# Altium schematic sheet Termoclanok.SchDoc
size A
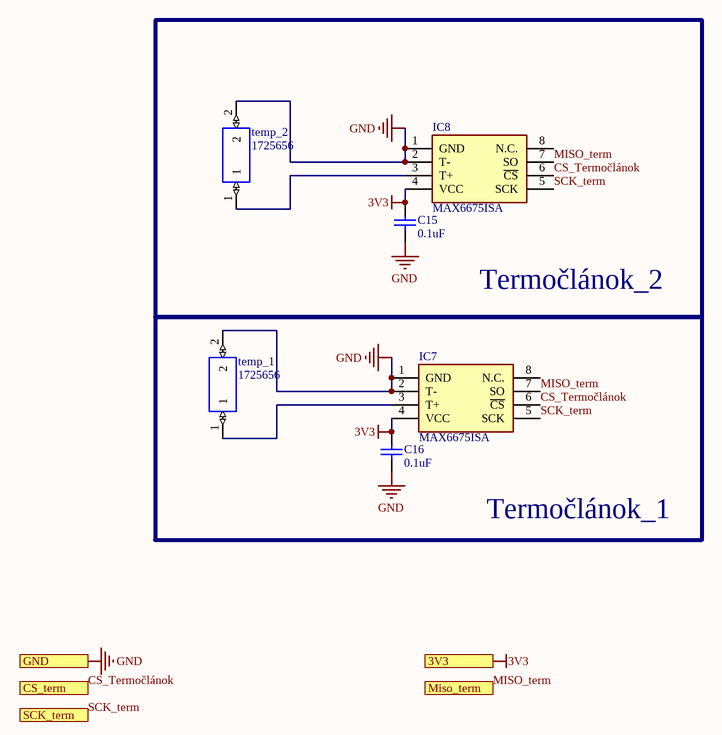
[diagram p0: Termoclanok.SchDoc]

## Parts
C15  0.1uF  [1608[0603]]
C16  0.1uF  [1608[0603]]
IC7  MAX6675ISA  [SOIC127P600X175-8N]
IC8  MAX6675ISA  [SOIC127P600X175-8N]
temp_1  1725656  [282834-2_1]
temp_2  1725656  [282834-2_1]

## Blocks framed on the sheet
Termočlánok_2: C15 IC8 temp_2
Termočlánok_1: C16 IC7 temp_1

## Ports
3V3 (in), CS_term (in), GND (in), Miso_term (in), SCK_term (in)

## Nets
3V3: C15.2 C16.2 IC7.4(VCC) IC8.4(VCC) ; port 3V3
GND: C15.1 C16.1 IC7.1(GND) IC7.2(T-) IC8.1(GND) IC8.2(T-) temp_1.2 temp_2.2 ; port GND
CS_Termočlánok: IC7.6(~{CS}) IC8.6(~{CS}) ; port CS_term
MISO_term: IC7.7(SO) IC8.7(SO) ; port Miso_term
SCK_term: IC7.5(SCK) IC8.5(SCK) ; port SCK_term
NetIC7_3: IC7.3(T+) temp_1.1
NetIC8_3: IC8.3(T+) temp_2.1

Not connected (* = marked no-connect by the designer): IC7 8(N.C.); IC8 8(N.C.)

## Library data of the parts
C15 C16 = Cap Semi: Capacitor (Semiconductor SIM Model); Published: 8-Jun-2000; LatestRevisionDate: 29-May-2009; LatestRevisionNote: IPC-7351 Footprint Added.; PackageReference: C1206; Publisher: Altium Limited; PackageDescription: Chip Capacitor; Value: 0.1uF
IC7 IC8 = MAX6675ISA: Integrated Circuit; Manufacturer_Name: Maxim Integrated; Datasheet Link: http://datasheets.maximintegrated.com/en/ds/MAX6675.pdf; Height: 1.75mm; Manufacturer_Part_Number: MAX6675ISA; Mouser Part Number: N/A; Mouser Price/Stock: https://www.mouser.com/Search/Refine.aspx?Keyword=N%2FA
temp_1 temp_2 = 1725656: 2 way PCB vertical mount terminal,2.54mm 2 way PCB vertical mount terminal,2.54mm; Manufacturer_Name: Phoenix Contact; Allied_Number: 70054335; Geometry.Height: 8mm; Manufacturer_Part_Number: 1725656; RS Part Number: 2204260; RS Price/Stock: http://uk.rs-online.com/web/p/products/2204260; Allied Price/Stock: http://www.alliedelec.com/phoenix-contact-1725656/70054335/; Arrow Part Number: 1725656; Arrow Price/Stock: https://www.arrow.com/en/products/1725656/phoenix-contact; Datasheet Link: https://www.phoenixcontact.com/online/portal/gb?uri=pxc-oc-itemdetail:pid=1725656&library=gben&tab=1